# EAGLE design ATtiny85ISP_board (EAGLE 7.2.0)
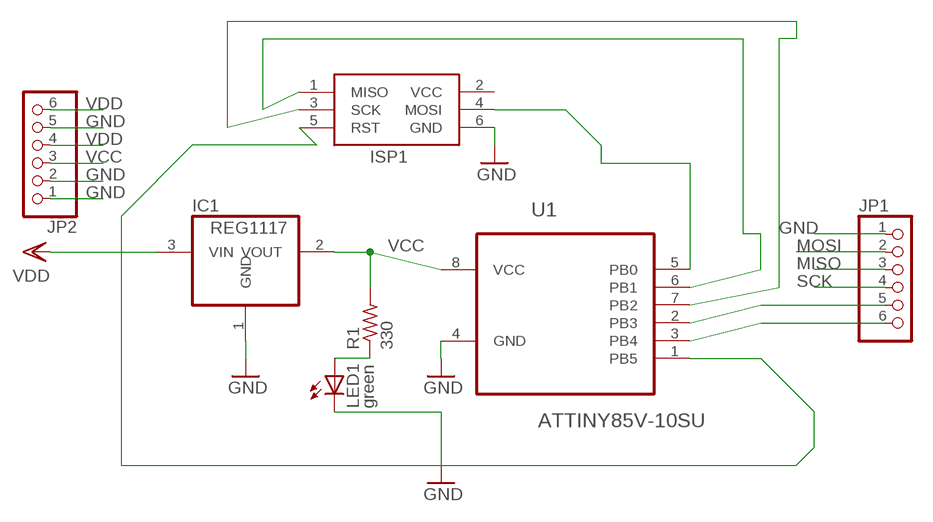
[diagram p0: schematic, sheet 1]

## Parts
IC1  REG1117  [SOT223]
ISP1  AVRISP-6  [AVRISP]
JP1  PINHD-1X6  [1X06]
JP2  PINHD-1X6  [1X06]
LED1  green  LEDCHIPLED_0805  [CHIPLED_0805]
R1  330  R-US_M1206  [M1206]
U1  ATTINY85V-10SU  [SOIC127P798X216-8N]

## Nets
GND: IC1.1(GND) ISP1.6(GND) JP1.1 JP2.1 JP2.2 JP2.5 LED1.C U1.4(GND)
MISO: ISP1.1(MISO) JP1.3 U1.6(PB1)
MOSI: ISP1.4(MOSI) JP1.2 U1.5(PB0)
N$1: LED1.A R1.1
PIN3: JP1.5 U1.2(PB3)
PIN4: JP1.6 U1.3(PB4)
RST: ISP1.5(RST) U1.1(PB5)
SCK: ISP1.3(SCK) JP1.4 U1.7(PB2)
VCC: IC1.2(VOUT) JP2.3 R1.2 U1.8(VCC)
VDD: IC1.3(VIN) JP2.4 JP2.6

## Power pins joined to a net without a drawn wire
VCC: ISP1.2(VCC)

## Library data of the parts
IC1 = burr-brown:REG1117: 800mA and 1A Low Dropout (LDO) Positive Regulator 1.8V, 2.5V, 2.85V, 3.3V, 5V, and Adj; MPN: REG1117; OC_FARNELL: 1097566; OC_NEWARK: 14P6981
ISP1 = adafruit:AVRISP: AVR ISP HEADER Standard 6 pin header for AVR programming
JP1 JP2 = adafruit:PINHD-1X6: PIN HEADER
LED1 = adafruit:LED: LED OSRAM: - CHIPLED LG R971, LG N971, LY N971, LG Q971, LY Q971, LO R971, LY R971 LH N974, LH R974 LS Q976, LO Q976, LY Q976 LO Q996 - Hyper CHIPLED LW Q18S LB Q993, LB Q99A, LB R99A - SideLED LS A670, LO A670, LY A670, LG A670, LP A670 LB A673, LV A673, LT A673, LW A673 LH A674 LY A675 LS A676, LA A676, LO A676, LY A676, LW A676 LS A679, LY A679, LG A679 - Hyper Micro SIDELED® LS Y876, LA Y876, LO Y876, LY Y876 LT Y87S - SmartLED LW L88C, LW L88S LB L89C, LB L89S, LG L890 LS L89K, LO L89K, LY L89K LS L896, LA L896, LO L896, LY L896 - TOPLED LS T670, LO T670, LY T670, LG T670, LP T670 LSG T670, LSP T670, LSY T670, LOP T670, LYG T670 LG T671, LOG T671, LSG T671 LB T673, LV T673, LT T673, LW T673 LH T674 LS T676, LA T676, LO T676, LY T676, LB T676, LH T676, LSB T676, LW T676 LB T67C, LV T67C, LT T67C, LS T67K, LO T67K, LY T67K, LW E67C LS E67B, LA E67B, LO E67B, LY E67B, LB E67C, LV E67C, LT E67C LW T67C LS T679, LY T679, LG T679 LS T770, LO T770, LY T770, LG T770, LP T770 LB T773, LV T773, LT T773, LW T773 LH T774 LS E675, LA E675, LY E675, LS T675 LS T776, LA T776, LO T776, LY T776, LB T776 LHGB T686 LT T68C, LB T68C - Hyper Mini TOPLED® LB M676 - Mini TOPLED Santana® LG M470 LS M47K, LO M47K, LY M47K Source: http://www.osram.convergy.de/
R1 = resistor:R-US_: RESISTOR, American symbol
U1 = Atmel_chips:ATTINY85V-10SU: 8-bit Microcontroller with In-System Programmable Flash; MPN: ATTINY85V-10SU; OC_FARNELL: 1455166; OC_NEWARK: 58M3799; PACKAGE: SOIC-8; SUPPLIER: Atmel

## Net classes
0 default: width 0.254 mm, drill 0.381 mm, clearance 0.254 mm

## Board
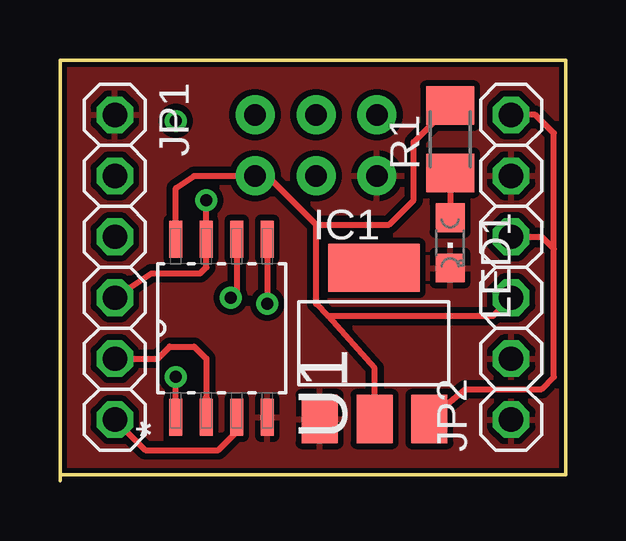
[diagram p1: board, top side]
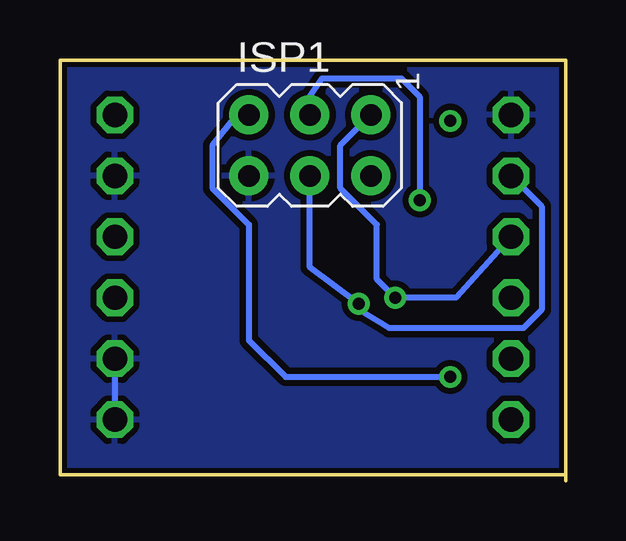
[diagram p2: board, bottom side, seen from below]

Size 21.08 x 17.53 mm. Coordinates in mm from the lower left corner, seen from the top.
Outline: 0,17.27 0,0.25 21.08,0.25 21.08,17.53 0,17.53 0,17.27
Outline: 0,0 0,17.27
Copper layers (1*16): Top 0.035mm / dielectric 1.5mm / Bottom 0.035mm
Design rules "default *": minimum track width 10mil, minimum drill 15mil, track to track 8mil, track to pad 8mil, pad to pad 8mil, via to via 8mil, smd to smd 8mil, copper to edge 8mil, drill to drill 5mil, minimum pad ring 10mil, minimum via ring 8mil, stop-mask expansion 4mil, vias tented up to drill 0mil, thermal gap 10mil

### Footprints (pad centres in the part's own frame; a part is rotated, then mirrored left to right if it is on the bottom)
SOT223 = smd 1.499 x 2.007: 1 -2.261,-3.15; 2 0.025,-3.15; 3 2.311,-3.15 | smd 3.81 x 2.007: 4 0,3.15
AVRISP = drill 0.9 pad 1.626: 1 -1.27,2.54; 2 1.27,2.54; 3 -1.27,0; 4 1.27,0; 5 -1.27,-2.54; 6 1.27,-2.54
1X06 = drill 1.016 octagon: 1 -6.35,0; 2 -3.81,0; 3 -1.27,0; 4 1.27,0; 5 3.81,0; 6 6.35,0
CHIPLED_0805 = smd 1.2 x 1.2: A 0,-1.05; C 0,1.05
M1206 = smd 1.6 x 2: 1 -1.4,0; 2 1.4,0
SOIC127P798X216-8N = smd 1.549 x 0.533: 1 -3.708,1.905; 2 -3.708,0.635; 3 -3.708,-0.635; 4 -3.708,-1.905; 5 3.708,-1.905; 6 3.708,-0.635; 7 3.708,0.635; 8 3.708,1.905

### Placement (x,y rotation side)
IC1  13.08,5.71 0 top
ISP1  10.67,13.97 270 bottom
JP1  2.29,8.89 270 top
JP2  18.8,8.89 90 top
LED1  16.26,9.91 180 top
R1  16.26,14.22 90 top
U1  6.73,6.35 90 top

### Tracks (layer width: path | path; a pad name or v marks a point on that pad's centre or on a via)
GND
  Bottom 0.254: JP2.2 JP2.1
  pour Top: -0.25,18.03 -0.25,-1.02 22.61,-1.02 22.61,18.03
  pour Bottom: -0.51,18.8 -0.51,-1.27 22.86,-1.02 22.61,18.29
MISO  (via drill 0.5)
  Top 0.254: U1.6 7.37,7.87 v7.11,7.62
  Bottom 0.254: JP1.3 4.57,7.62 v7.11,7.62 7.87,8.38 7.87,10.67 9.4,12.19 9.4,13.97 ISP1.1
MOSI  (via drill 0.5)
  Top 0.254: U1.5 v8.64,7.37
  Bottom 0.254: ISP1.4 10.67,8.89 v8.64,7.37 8.64,7.11 7.37,6.35 1.78,6.35 1.02,7.11 1.02,11.43 JP1.2
N$1
  Top 0.254: R1.1 LED1.A
N$3  (via drill 0.5)
  other vias: 4.83,14.99
PIN3
  Top 0.254: JP1.5 4.06,5.08 4.57,5.59 5.59,5.59 6.1,5.08 6.1,3.43
  Top 0.305: 6.1,3.43 U1.2
PIN4
  Top 0.254: JP1.6 3.56,1.27 6.6,1.27 7.37,2.03 U1.3
RST  (via drill 0.5)
  Top 0.254: U1.1 v4.83,4.32
  Bottom 0.254: ISP1.5 13.72,15.24 14.73,13.97 14.73,12.19 13.21,10.67 13.21,5.84 11.68,4.32 v4.83,4.32
SCK  (via drill 0.5)
  Top 0.254: JP1.4 3.81,8.64 5.84,8.64 6.1,8.89 U1.7 v6.1,11.68
  Bottom 0.254: ISP1.3 10.67,16 10.16,16.76 6.86,16.76 6.1,16 v6.1,11.68
VCC
  Top 0.254: U1.8 4.83,12.19 5.59,12.7 ISP1.2 8.64,12.7 10.67,10.67 | 10.67,10.67 13.72,10.67 14.73,11.68 14.73,14.1 R1.2 | JP2.3 18.03,6.86 11.18,6.86 | 11.18,6.86 10.67,7.37 10.67,10.67 | IC1.2 13.11,4.67 11.18,6.86
VDD
  Top 0.254: IC1.3 16.89,3.81 20.07,3.81 20.57,4.32 20.57,9.65 | 20.57,9.65 20.57,14.48 19.81,15.24 JP2.6 | JP2.4 20.07,10.16 20.57,9.65

### Text on the board
bTest: GND | VIN | 0 | GND | 1 | VIN | VCC | 2 | 3 | GND | ATtiny85 ISP / REV 1 | 4 | GND